# EAGLE design lpt2rs232 (EAGLE 4.13)
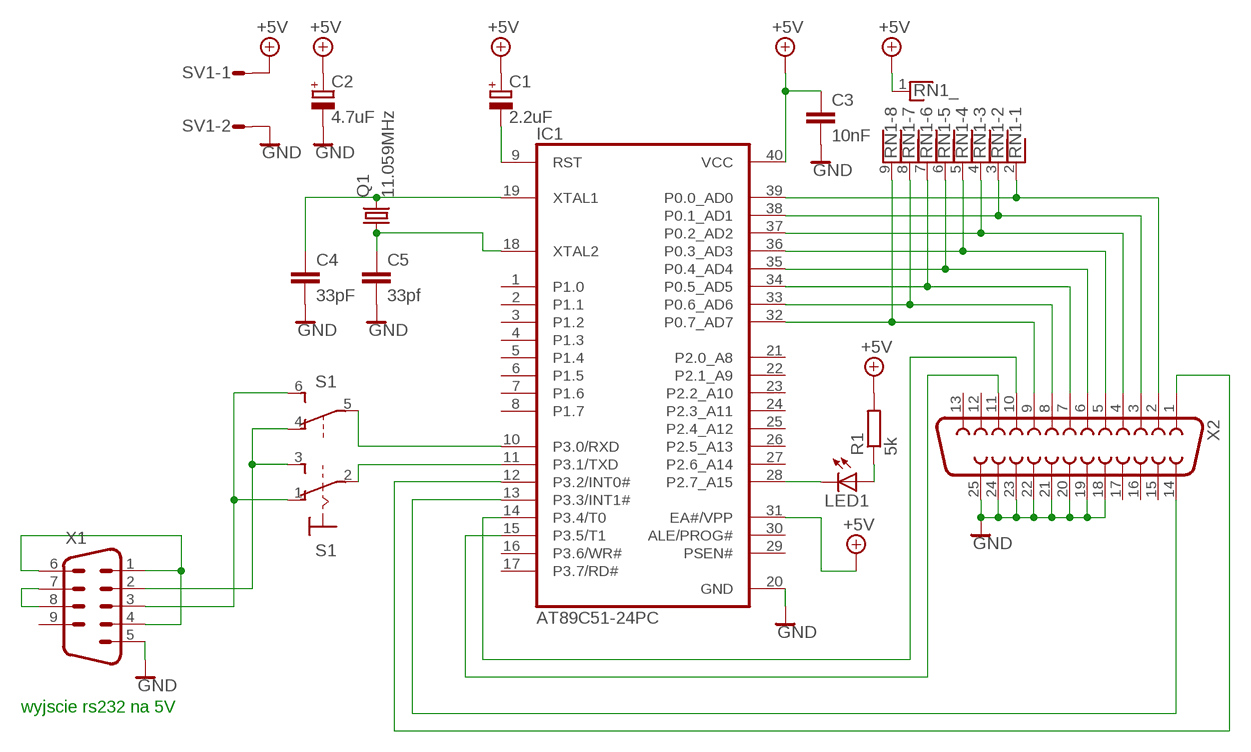
[diagram p0: schematic, sheet 1]

## Parts
C1  2.2uF  CPOL-EUE2,5-6E  [E2,5-6E]
C2  4.7uF  CPOL-EUE2,5-6E  [E2,5-6E]
C3  10nF  C-EU025-030X050  [C025-030X050]
C4  33pF  C-EU025-030X050  [C025-030X050]
C5  33pf  C-EU025-030X050  [C025-030X050]
IC1  AT89C51-24PC  [DIL40]
LED1  LED5MM  [LED5MM]
Q1  11.059MHz  CRYTALHC49S  [HC49/S]
R1  5k  R-EU_0204/7  [0204/7]
RN1  RNX8  [RN-9]
S1  320-938  [320-938]
SV1  L02P  [L02P]
X1  M09HP  [M09HP]
X2  F25HP  [F25HP]

## Nets
0V: C2.- C3.2 C4.2 C5.2 IC1.20(GND) SV1.2 X1.5 X2.18 X2.19 X2.20 X2.21 X2.22 X2.23 X2.24 X2.25 ; supply symbol labelled GND
+5V: C1.+ C2.+ C3.1 IC1.31(EA#/VPP) IC1.40(VCC) R1.2 RN1.1 SV1.1
N$1: X1.1 X1.4 X1.6
N$2: IC1.28(P2.7_A15) LED1.K(C)
N$3: X1.7 X1.8
N$4: S1.3(1:S) S1.4(B:O) X1.2
N$5: S1.1(1:O) S1.6(B:S) X1.3
N$6: C1.- IC1.9(RST)
N$7: LED1.A R1.1
N$8: IC1.39(P0.0_AD0) RN1.2 X2.2
N$9: IC1.38(P0.1_AD1) RN1.3 X2.3
N$10: IC1.37(P0.2_AD2) RN1.4 X2.4
N$11: IC1.36(P0.3_AD3) RN1.5 X2.5
N$12: IC1.35(P0.4_AD4) RN1.6 X2.6
N$13: IC1.34(P0.5_AD5) RN1.7 X2.7
N$14: IC1.33(P0.6_AD6) RN1.8 X2.8
N$15: IC1.32(P0.7_AD7) RN1.9 X2.9
N$16: IC1.12(P3.2/INT0#) X2.1
N$17: IC1.13(P3.3/INT1#) X2.14
N$18: IC1.15(P3.5/T1) X2.11
N$19: C4.1 IC1.19(XTAL1) Q1.2
N$20: C5.1 IC1.18(XTAL2) Q1.1
N$21: IC1.14(P3.4/T0) X2.10
N$22: IC1.11(P3.1/TXD) S1.2(1:P)
N$23: IC1.10(P3.0/RXD) S1.5(B:P)
Unconnected: IC1.1(P1.0) IC1.2(P1.1) IC1.3(P1.2) IC1.4(P1.3) IC1.5(P1.4) IC1.6(P1.5) IC1.7(P1.6) IC1.8(P1.7) IC1.16(P3.6/WR#) IC1.17(P3.7/RD#) IC1.21(P2.0_A8) IC1.22(P2.1_A9) IC1.23(P2.2_A10) IC1.24(P2.3_A11) IC1.25(P2.4_A12) IC1.26(P2.5_A13) IC1.27(P2.6_A14) IC1.29(PSEN#) IC1.30(ALE/PROG#) X1.9 X2.12 X2.13 X2.15 X2.16 X2.17

## Notes on the sheet
- wyjscie rs232 na 5V

## Library data of the parts
C1 C2 = rcl:CPOL-EU: POLARIZED CAPACITOR, European symbol
C3-C5 = rcl:C-EU: CAPACITOR, European symbol
IC1 = atmel:AT89C51-*: 8-bit Microcontroller with 4K Bytes Flash Not Recommended for New Designs. Use AT89S51. Source: http://www.atmel.com/dyn/resources/prod_documents/doc0265.
LED1 = led:LED: LED OSRAM: - CHIPLED LG R971, LG N971, LY N971, LG Q971, LY Q971, LO R971, LY R971 LH N974, LH R974 LS Q976, LO Q976, LY Q976 LO Q996 - Hyper CHIPLED LW Q18S LB Q993, LB Q99A, LB R99A - SideLED LS A670, LO A670, LY A670, LG A670, LP A670 LB A673, LV A673, LT A673, LW A673 LH A674 LY A675 LS A676, LA A676, LO A676, LY A676, LW A676 LS A679, LY A679, LG A679 - Hyper Micro SIDELED® LS Y876, LA Y876, LO Y876, LY Y876 LT Y87S - SmartLED LW L88C, LW L88S LB L89C, LB L89S, LG L890 LS L89K, LO L89K, LY L89K LS L896, LA L896, LO L896, LY L896 - TOPLED LS T670, LO T670, LY T670, LG T670, LP T670 LSG T670, LSP T670, LSY T670, LOP T670, LYG T670 LG T671, LOG T671, LSG T671 LB T673, LV T673, LT T673, LW T673 LH T674 LS T676, LA T676, LO T676, LY T676, LB T676, LH T676, LSB T676, LW T676 LB T67C, LV T67C, LT T67C, LS T67K, LO T67K, LY T67K, LW E67C LS E67B, LA E67B, LO E67B, LY E67B, LB E67C, LV E67C, LT E67C LW T67C LS T679, LY T679, LG T679 LS T770, LO T770, LY T770, LG T770, LP T770 LB T773, LV T773, LT T773, LW T773 LH T774 LS E675, LA E675, LY E675, LS T675 LS T776, LA T776, LO T776, LY T776, LB T776 LHGB T686 LT T68C, LB T68C - Hyper Mini TOPLED® LB M676 - Mini TOPLED Santana® LG M470 LS M47K, LO M47K, LY M47K Source: http://www.osram.convergy.de/
Q1 = crystal:CRYTAL: CRYSTAL
R1 = rcl:R-EU_: RESISTOR, European symbol
RN1 = resistor-net:RNX8: RESISTOR NETWORK
S1 = switch:320-938: TOGGLE SWITCH distributor RS Components
SV1 = con-amp-mt:L02P: AMP MT CONNECTOR
X1 = con-subd:M09: SUB-D
X2 = con-subd:F25: SUB-D

## Board
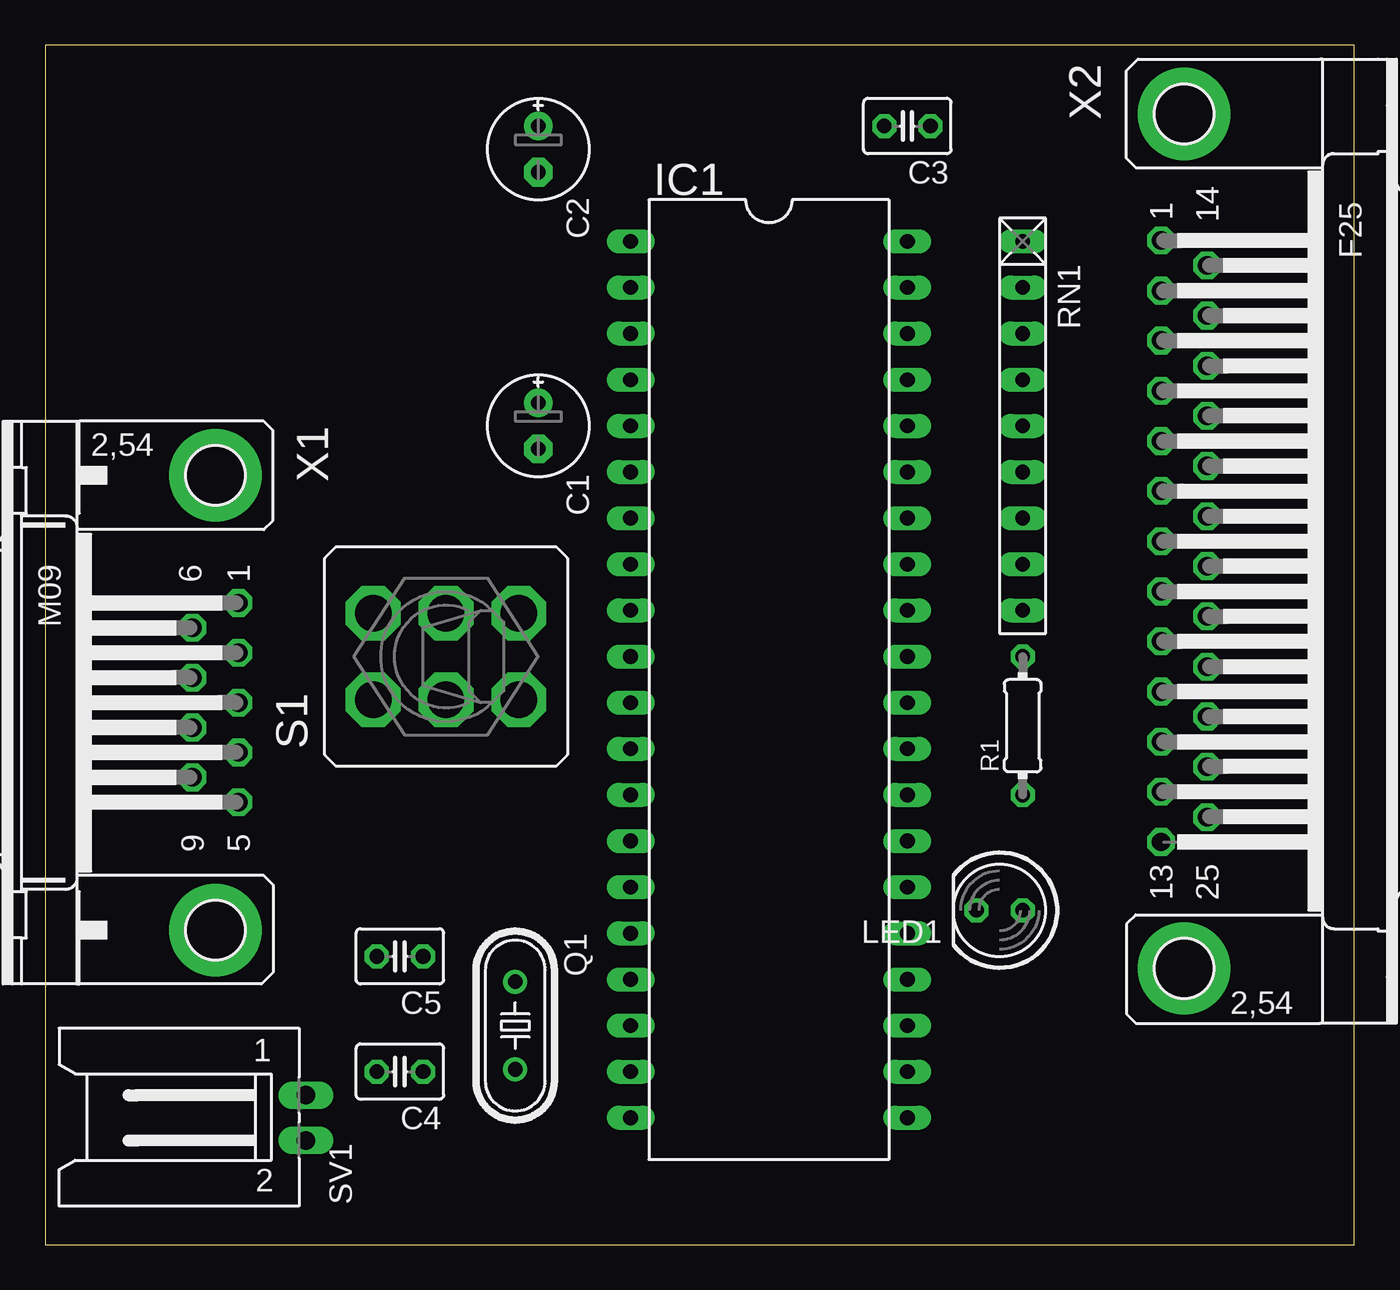
[diagram p1: board, top side]
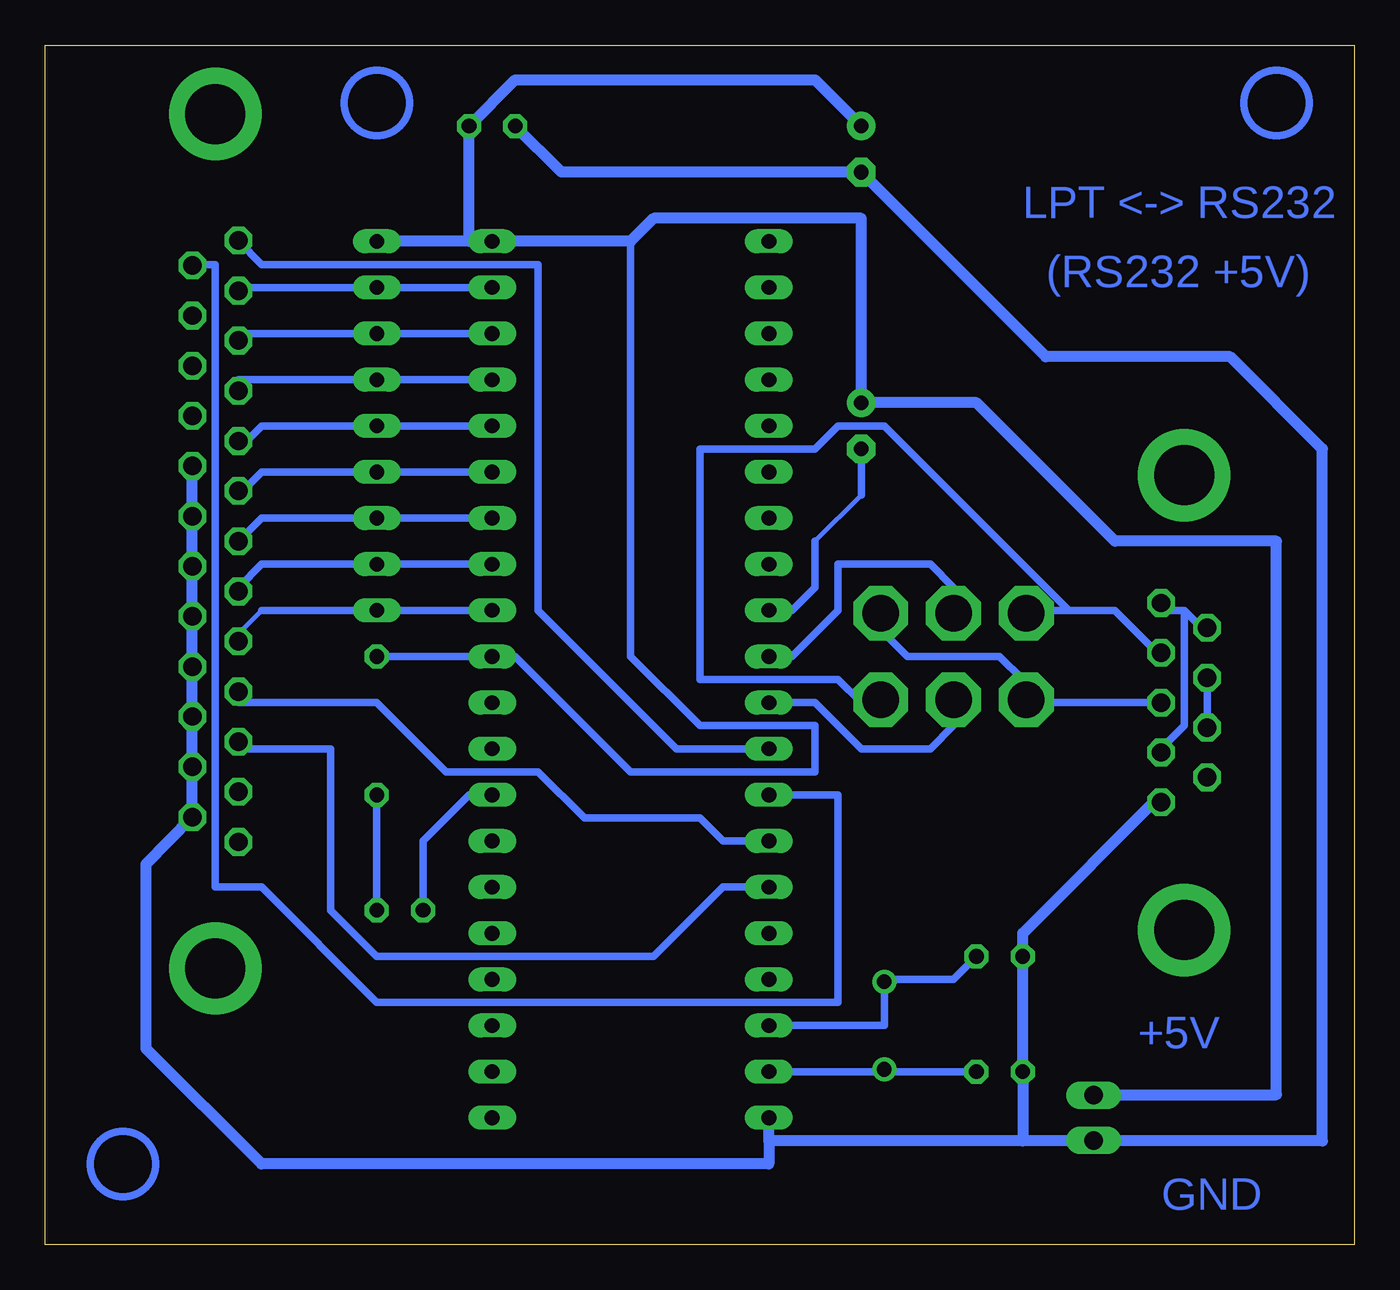
[diagram p2: board, bottom side, seen from below]

Size 72.06 x 66.03 mm. Coordinates in mm from the lower left corner, seen from the top.
Outline: 0,0 72.06,0 72.06,66.03 0,66.03 0,0
Copper layers (1*16): Top 0.035mm / dielectric 1.5mm / Bottom 0.035mm
Design rules "default": minimum track width 10mil, minimum drill 24mil, track to track 8mil, track to pad 8mil, pad to pad 8mil, via to via 8mil, smd to smd 8mil, copper to edge 40mil, drill to drill 8mil, minimum pad ring 10mil, minimum via ring 8mil, stop-mask expansion 4mil, vias tented up to drill 0mil, thermal gap 10mil

### Footprints (pad centres in the part's own frame; a part is rotated, then mirrored left to right if it is on the bottom)
E2,5-6E = drill 0.813 pad 1.575 round: + -1.27,0 | drill 0.813 pad 1.575 octagon: - 1.27,0
C025-030X050 = drill 0.813 octagon: 1 -1.27,0; 2 1.27,0
DIL40 = drill 0.813 long: 1 -24.13,-7.62; 2 -21.59,-7.62; 3 -19.05,-7.62; 4 -16.51,-7.62; 5 -13.97,-7.62; 6 -11.43,-7.62; 7 -8.89,-7.62; 8 -6.35,-7.62; 9 -3.81,-7.62; 10 -1.27,-7.62; 11 1.27,-7.62; 12 3.81,-7.62; 13 6.35,-7.62; 14 8.89,-7.62; 15 11.43,-7.62; 16 13.97,-7.62; 17 16.51,-7.62; 18 19.05,-7.62; 19 21.59,-7.62; 20 24.13,-7.62; 21 24.13,7.62; 22 21.59,7.62; 23 19.05,7.62; 24 16.51,7.62; 25 13.97,7.62; 26 11.43,7.62; 27 8.89,7.62; 28 6.35,7.62; 29 3.81,7.62; 30 1.27,7.62; 31 -1.27,7.62; 32 -3.81,7.62; 33 -6.35,7.62; 34 -8.89,7.62; 35 -11.43,7.62; 36 -13.97,7.62; 37 -16.51,7.62; 38 -19.05,7.62; 39 -21.59,7.62; 40 -24.13,7.62
LED5MM = drill 0.813 octagon: A -1.27,0; K 1.27,0
HC49/S = drill 0.813 round: 1 -2.413,0; 2 2.413,0
0204/7 = drill 0.813 octagon: 1 -3.81,0; 2 3.81,0
RN-9 = drill 0.813 long: 1 -10.16,0; 2 -7.62,0; 3 -5.08,0; 4 -2.54,0; 5 0,0; 6 2.54,0; 7 5.08,0; 8 7.62,0; 9 10.16,0
320-938 = drill 2.007 octagon: 1 -2.388,4.013; 2 -2.388,0; 3 -2.388,-4.013; 4 2.388,4.013; 5 2.388,0; 6 2.388,-4.013
L02P = drill 1.016 long: 1 1.25,-6.25; 2 -1.25,-6.25
M09HP = drill 1.016 octagon: 1 -5.486,1.27; 2 -2.743,1.27; 3 0,1.27; 4 2.743,1.27; 5 5.486,1.27; 6 -4.115,-1.27; 7 -1.372,-1.27; 8 1.372,-1.27; 9 4.115,-1.27 | drill 3.302 pad 5.08 round: G1 -12.522,0; G2 12.522,0
F25HP = drill 1.016 octagon: 1 -16.561,-1.27; 2 -13.792,-1.27; 3 -11.049,-1.27; 4 -8.28,-1.27; 5 -5.512,-1.27; 6 -2.769,-1.27; 7 0,-1.27; 8 2.769,-1.27; 9 5.512,-1.27; 10 8.28,-1.27; 11 11.049,-1.27; 12 13.792,-1.27; 13 16.561,-1.27; 14 -15.189,1.27; 15 -12.421,1.27; 16 -9.652,1.27; 17 -6.909,1.27; 18 -4.14,1.27; 19 -1.372,1.27; 20 1.372,1.27; 21 4.14,1.27; 22 6.909,1.27; 23 9.652,1.27; 24 12.421,1.27; 25 15.189,1.27 | drill 3.302 pad 5.08 round: G1 -23.52,0; G2 23.52,0

### Placement (x,y rotation side)
C1  27.14,45.08 270 top
C2  27.14,60.32 270 top
C3  47.46,61.59 180 top
C4  19.52,9.52 180 top
C5  19.52,15.87 180 top
IC1  39.84,31.11 270 top
LED1  52.54,18.41 180 top
Q1  25.87,12.06 270 top
R1  53.81,28.57 90 top
RN1  53.81,45.08 270 top
S1  22.06,32.38 90 top
SV1  8.09,6.98 90 top
X1  9.36,29.84 270 top
X2  62.7,38.73 270 top

### Tracks (layer width: path | path; a pad name or v marks a point on that pad's centre or on a via)
0V
  Bottom 0.254: 10.63,24.76 X1.5
  Bottom 0.61: C3.2 43.65,59.05 C2.- 16.98,48.89 6.82,48.89 1.74,43.81 1.74,5.71 13.17,5.71 SV1.2 15.71,5.71 18.25,5.71 | X2.18 X2.19 X2.20 X2.21 X2.22 X2.23 X2.24 X2.25 66.51,20.95 66.51,10.79 60.16,4.44 32.22,4.44 32.22,5.71 | 32.22,5.71 IC1.20 | 10.63,24.76 18.25,17.14 C5.2 C4.2 18.25,5.71 | 18.25,5.71 32.22,5.71
+5V
  Bottom 0.254: 46.19,32.38 IC1.31
  Bottom 0.406: IC1.31 R1.2 | 46.19,32.38 39.84,26.03 29.68,26.03 29.68,28.57 36.03,28.57 39.84,32.38 39.84,55.24
  Bottom 0.61: 48.73,55.24 RN1.1 | 48.73,55.24 C3.1 46.19,64.13 29.68,64.13 C2.+ | 48.73,55.24 IC1.40 39.84,55.24 38.57,56.51 27.14,56.51 C1.+ 20.79,46.35 13.17,38.73 4.28,38.73 4.28,8.25 13.17,8.25 SV1.1
N$1
  Bottom 0.254: X1.4 10.63,27.3 | 10.63,34.92 X1.1
  Bottom 0.406: 10.63,27.3 9.36,28.57 9.36,34.92 | 9.36,34.92 8.09,33.65 X1.6 | 9.36,34.92 10.63,34.92
N$2
  Bottom 0.254: 48.73,24.76 IC1.28
  Bottom 0.406: 48.73,24.76 51.27,22.22 LED1.K
N$3
  Bottom 0.406: X1.8 X1.7
N$4
  Bottom 0.254: X1.2 10.63,32.38 | 27.14,29.84 S1.3
  Bottom 0.406: 10.63,32.38 13.17,34.92 15.71,34.92 | 15.71,34.92 16.98,34.92 S1.4 | 27.14,29.84 28.41,31.11 36.03,31.11 36.03,43.81 29.68,43.81 28.41,45.08 25.87,45.08 15.71,34.92
N$5
  Bottom 0.406: X1.3 16.98,29.84 S1.1 18.25,31.11 19.52,32.38 24.6,32.38 25.87,33.65 S1.6
N$6
  Bottom 0.254: 29.68,38.73 27.14,41.27 | 30.95,34.92 IC1.9
  Bottom 0.406: 30.95,34.92 29.68,36.19 29.68,38.73 | 27.14,41.27 C1.-
N$7
  Bottom 0.406: LED1.A R1.1
N$8
  Bottom 0.254: 61.43,52.7 X2.2
  Bottom 0.406: IC1.39 RN1.2 61.43,52.7
N$9
  Bottom 0.406: IC1.38 RN1.3 61.43,50.16 X2.3
N$10
  Bottom 0.406: IC1.37 RN1.4 61.43,47.62 X2.4
N$11
  Bottom 0.254: 61.43,43.81 X2.5
  Bottom 0.406: IC1.36 RN1.5 60.16,45.08 61.43,43.81
N$12
  Bottom 0.254: 61.43,41.27 X2.6
  Bottom 0.406: IC1.35 RN1.6 60.16,42.54 61.43,41.27
N$13
  Bottom 0.406: IC1.34 RN1.7 60.16,40 X2.7
N$14
  Bottom 0.254: 61.43,36.19 X2.8
  Bottom 0.406: IC1.33 RN1.8 60.16,37.46 61.43,36.19
N$15
  Bottom 0.254: 60.16,34.92 61.43,33.65
  Bottom 0.406: IC1.32 RN1.9 60.16,34.92 | 61.43,33.65 X2.9
N$16
  Bottom 0.254: 61.43,55.24 X2.1
  Bottom 0.406: 61.43,55.24 60.16,53.97 44.92,53.97 44.92,34.92 37.3,27.3 IC1.12
N$17
  Bottom 0.254: 63.97,53.97 X2.14
  Bottom 0.406: 63.97,53.97 62.7,53.97 62.7,19.68 60.16,19.68 53.81,13.33 28.41,13.33 28.41,24.76 IC1.13
N$18
  Bottom 0.254: 61.43,27.3 X2.11
  Bottom 0.406: 61.43,27.3 56.35,27.3 56.35,18.41 53.81,15.87 38.57,15.87 34.76,19.68 IC1.15
N$19
  Bottom 0.254: 27.14,9.52 Q1.2
  Bottom 0.406: C4.1 27.14,9.52 IC1.19
N$20
  Bottom 0.254: 25.87,14.6 Q1.1
  Bottom 0.406: IC1.18 25.87,12.06 25.87,14.6 22.06,14.6 C5.1
N$21
  Bottom 0.254: 61.43,29.84 X2.10
  Bottom 0.406: 61.43,29.84 53.81,29.84 50,26.03 44.92,26.03 42.38,23.49 36.03,23.49 34.76,22.22 IC1.14
N$22
  Bottom 0.406: IC1.11 29.68,29.84 27.14,27.3 23.33,27.3 22.06,28.57 S1.2
N$23
  Bottom 0.254: 30.95,32.38 IC1.10
  Bottom 0.406: 30.95,32.38 28.41,34.92 28.41,37.46 23.33,37.46 22.06,36.19 S1.5
(copper drawn outside any net)
  shapes: Bottom circle x3

### Text on the board
Bottom: LPT <-> RS232 | (RS232 +5V) | +5V | GND